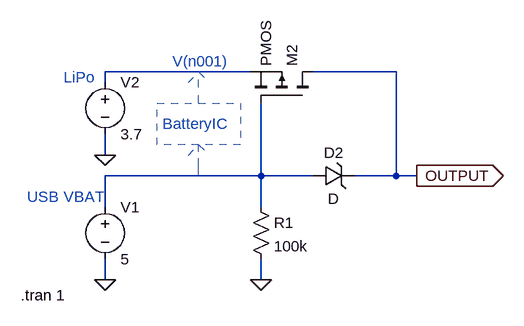
[diagram p0: schematic USB_and_LiPo.asc]
USB_and_LiPo.asc, the LTspice schematic file:
Version 4
SHEET 1 880 680
WIRE 352 64 128 64
WIRE 576 64 448 64
WIRE 128 80 128 64
WIRE 128 192 128 160
WIRE 368 224 368 112
WIRE 368 224 128 224
WIRE 448 224 368 224
WIRE 576 224 576 64
WIRE 576 224 512 224
WIRE 608 224 576 224
WIRE 128 272 128 224
WIRE 368 272 368 224
WIRE 128 384 128 352
WIRE 368 384 368 352
FLAG 608 224 OUTPUT
IOPIN 608 224 Out
FLAG 128 192 0
FLAG 128 384 0
FLAG 368 384 0
SYMBOL pmos 448 112 M270
SYMATTR InstName M2
SYMBOL res 352 256 R0
SYMATTR InstName R1
SYMATTR Value 100k
SYMBOL voltage 128 256 R0
SYMATTR InstName V1
SYMATTR Value 5
SYMBOL voltage 128 64 R0
WINDOW 123 0 0 Left 0
WINDOW 39 0 0 Left 0
SYMATTR InstName V2
SYMATTR Value 3.7
SYMBOL zener 448 240 R270
WINDOW 0 36 32 VTop 2
WINDOW 3 -4 32 VBottom 2
SYMATTR InstName D2
TEXT 8 256 Left 2 ;USB VBAT
TEXT 64 72 Left 2 ;LiPo
TEXT -2 408 Left 2 !.tran 1
TEXT 216 144 Left 2 ;BatteryIC
TEXT 232 48 Left 2 ;V(n001)
LINE Normal 208 176 208 112 2
LINE Normal 336 176 208 176 2
LINE Normal 336 112 336 176 2
LINE Normal 208 112 336 112 2
LINE Normal 272 208 272 176 2
LINE Normal 272 224 272 224 2
LINE Normal 272 64 272 64 2
LINE Normal 272 112 272 64 2
LINE Normal 272 224 272 208 2
LINE Normal 256 192 272 176 2
LINE Normal 272 176 288 192 2
LINE Normal 256 80 272 64 2
LINE Normal 272 64 288 80 2

The netlist it stands for:
* USB_and_LiPo.asc
M2 OUTPUT N002 N001 N001 PMOS
R1 N002 0 100k
V1 N002 0 5
V2 N001 0 3.7
D2 N002 OUTPUT D
.model D D
.lib standard.dio
.model NMOS NMOS
.model PMOS PMOS
.lib standard.mos
* USB VBAT
* LiPo
.tran 1
* BatteryIC
* V(n001)
.backanno
.end